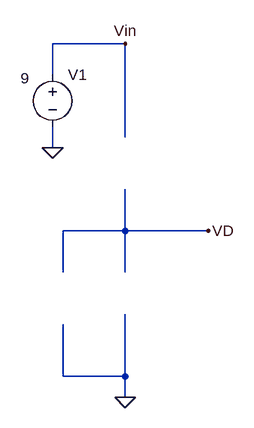
[diagram p0: schematic simple_diode.asc]
simple_diode.asc, the LTspice schematic file:
Version 4
SHEET 1 880 680
WIRE -224 -336 -336 -336
WIRE -336 -288 -336 -336
WIRE -224 -192 -224 -336
WIRE -336 -176 -336 -208
WIRE -224 -48 -224 -112
WIRE -224 -48 -320 -48
WIRE -96 -48 -224 -48
WIRE -320 16 -320 -48
WIRE -224 16 -224 -48
WIRE -320 176 -320 96
WIRE -224 176 -224 80
WIRE -224 176 -320 176
WIRE -224 208 -224 176
FLAG -224 208 0
FLAG -96 -48 VD
FLAG -336 -176 0
FLAG -224 -336 Vin
SYMBOL voltage -336 -304 R0
WINDOW 3 -49 21 Left 2
WINDOW 123 0 0 Left 2
WINDOW 39 -153 12 Left 2
SYMATTR Value 9
SYMATTR InstName V1

The netlist it stands for:
* simple_diode.asc
V1 Vin 0 9
.backanno
.end